# EAGLE board EEG_cap_final (EAGLE 9.6.2)
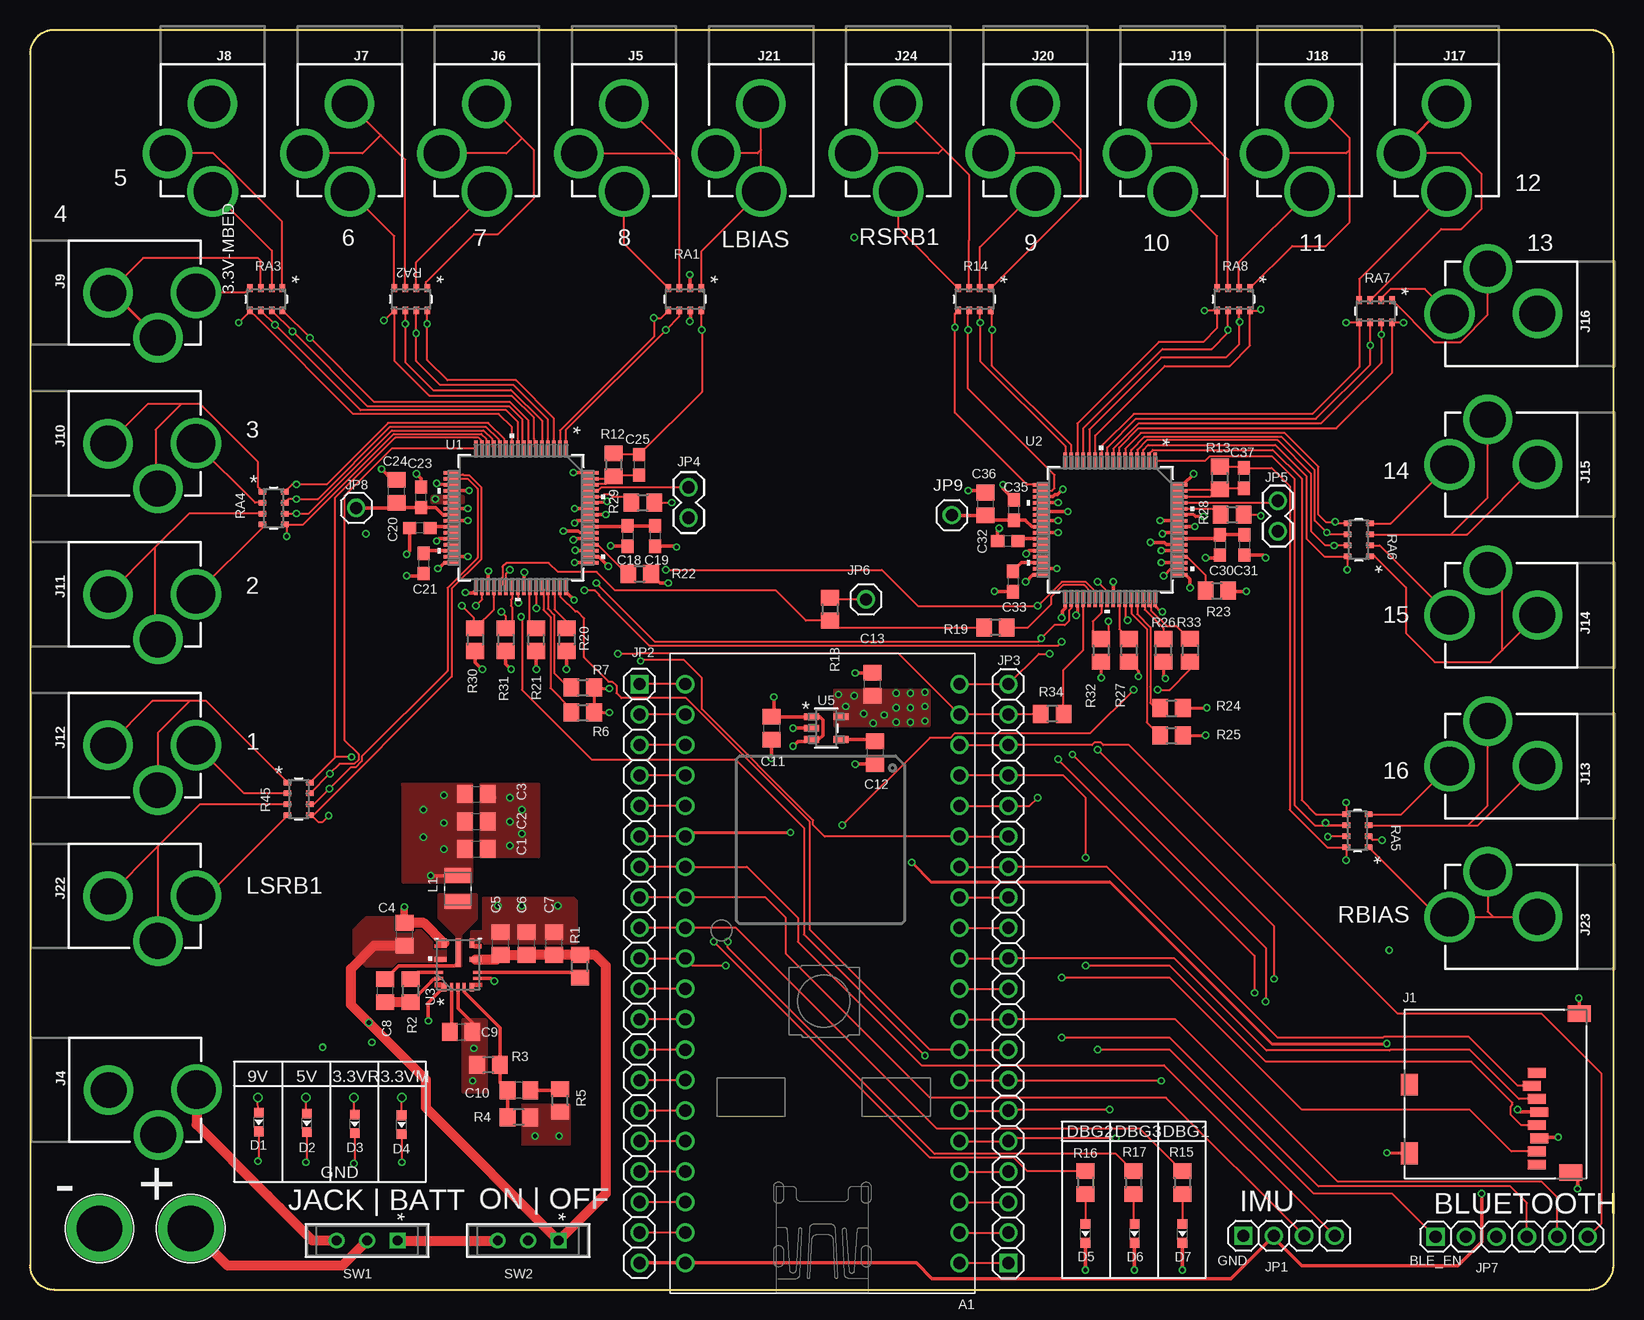
[diagram p4: board, top side]
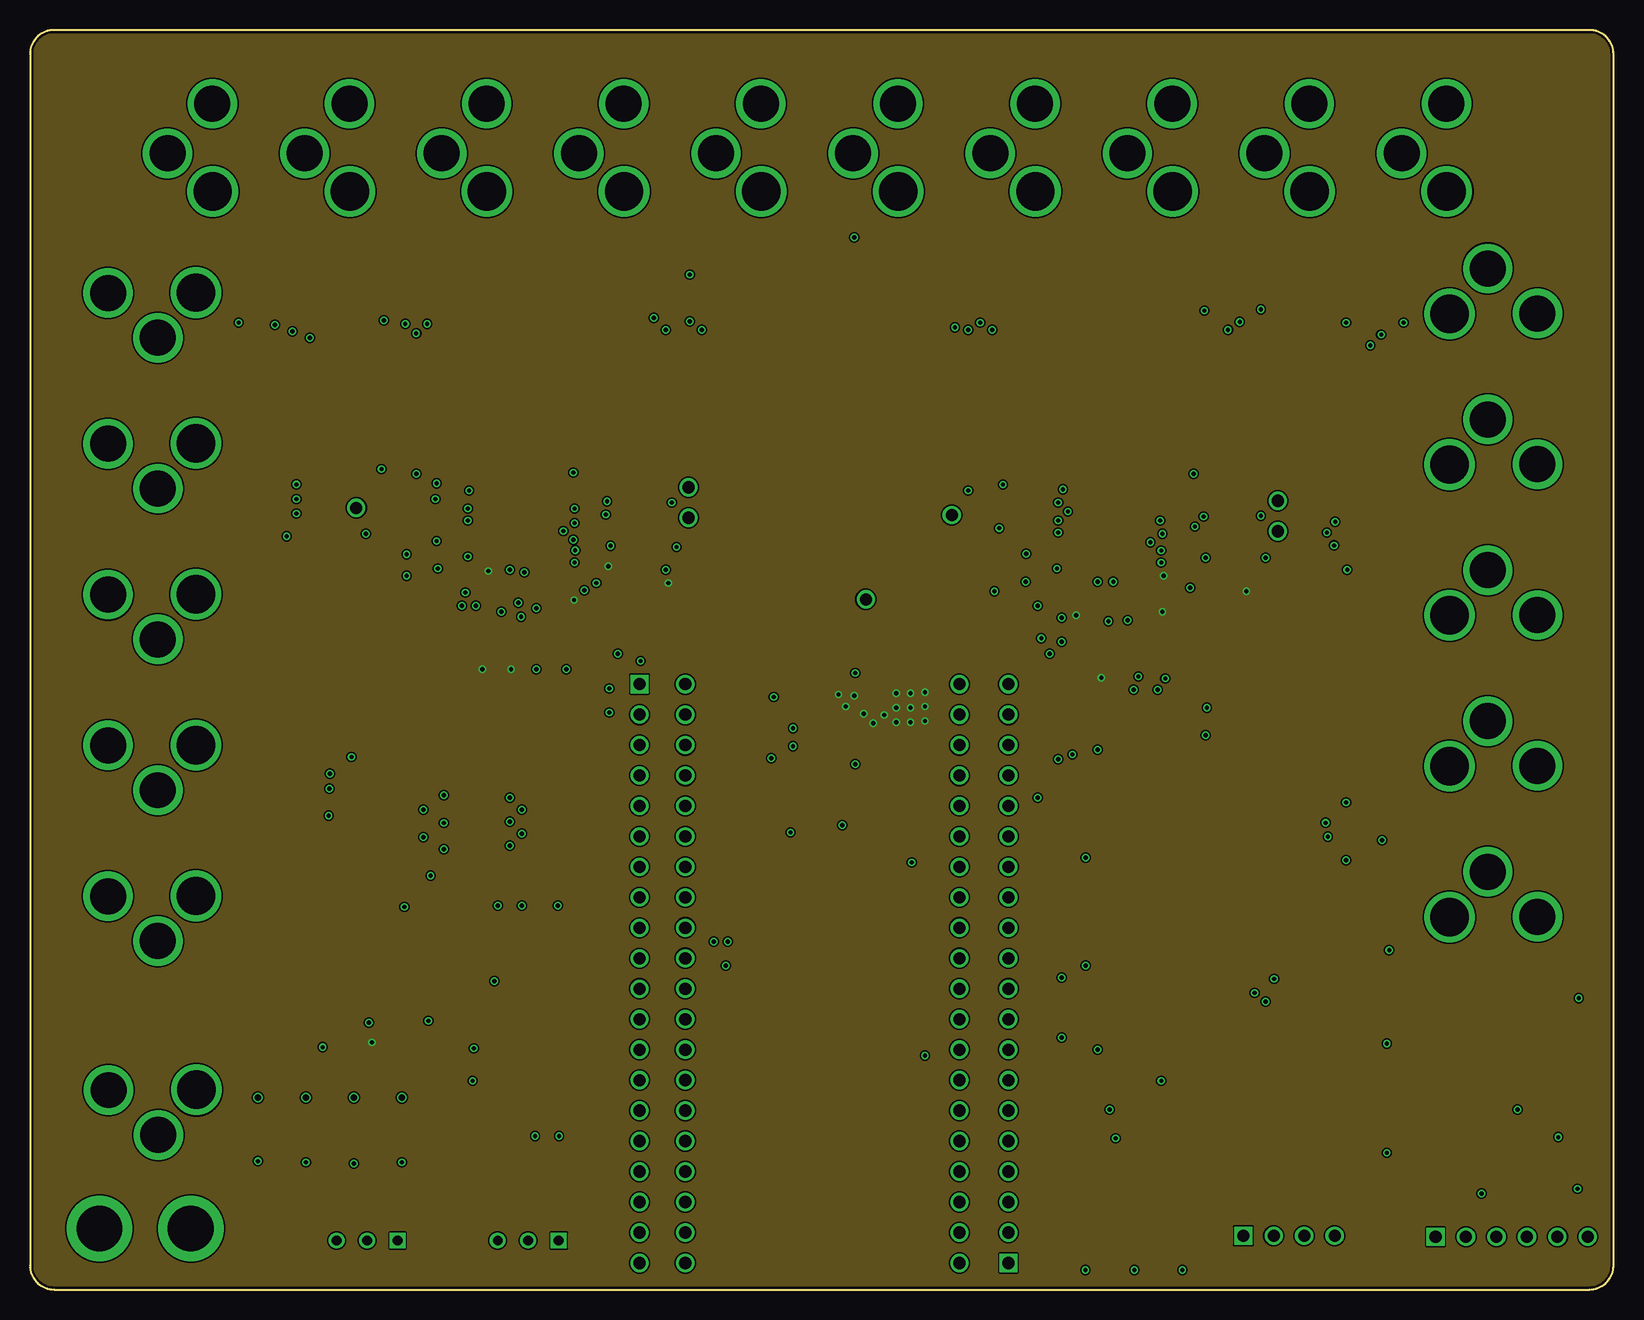
[diagram p5: board, inner layer Route2]
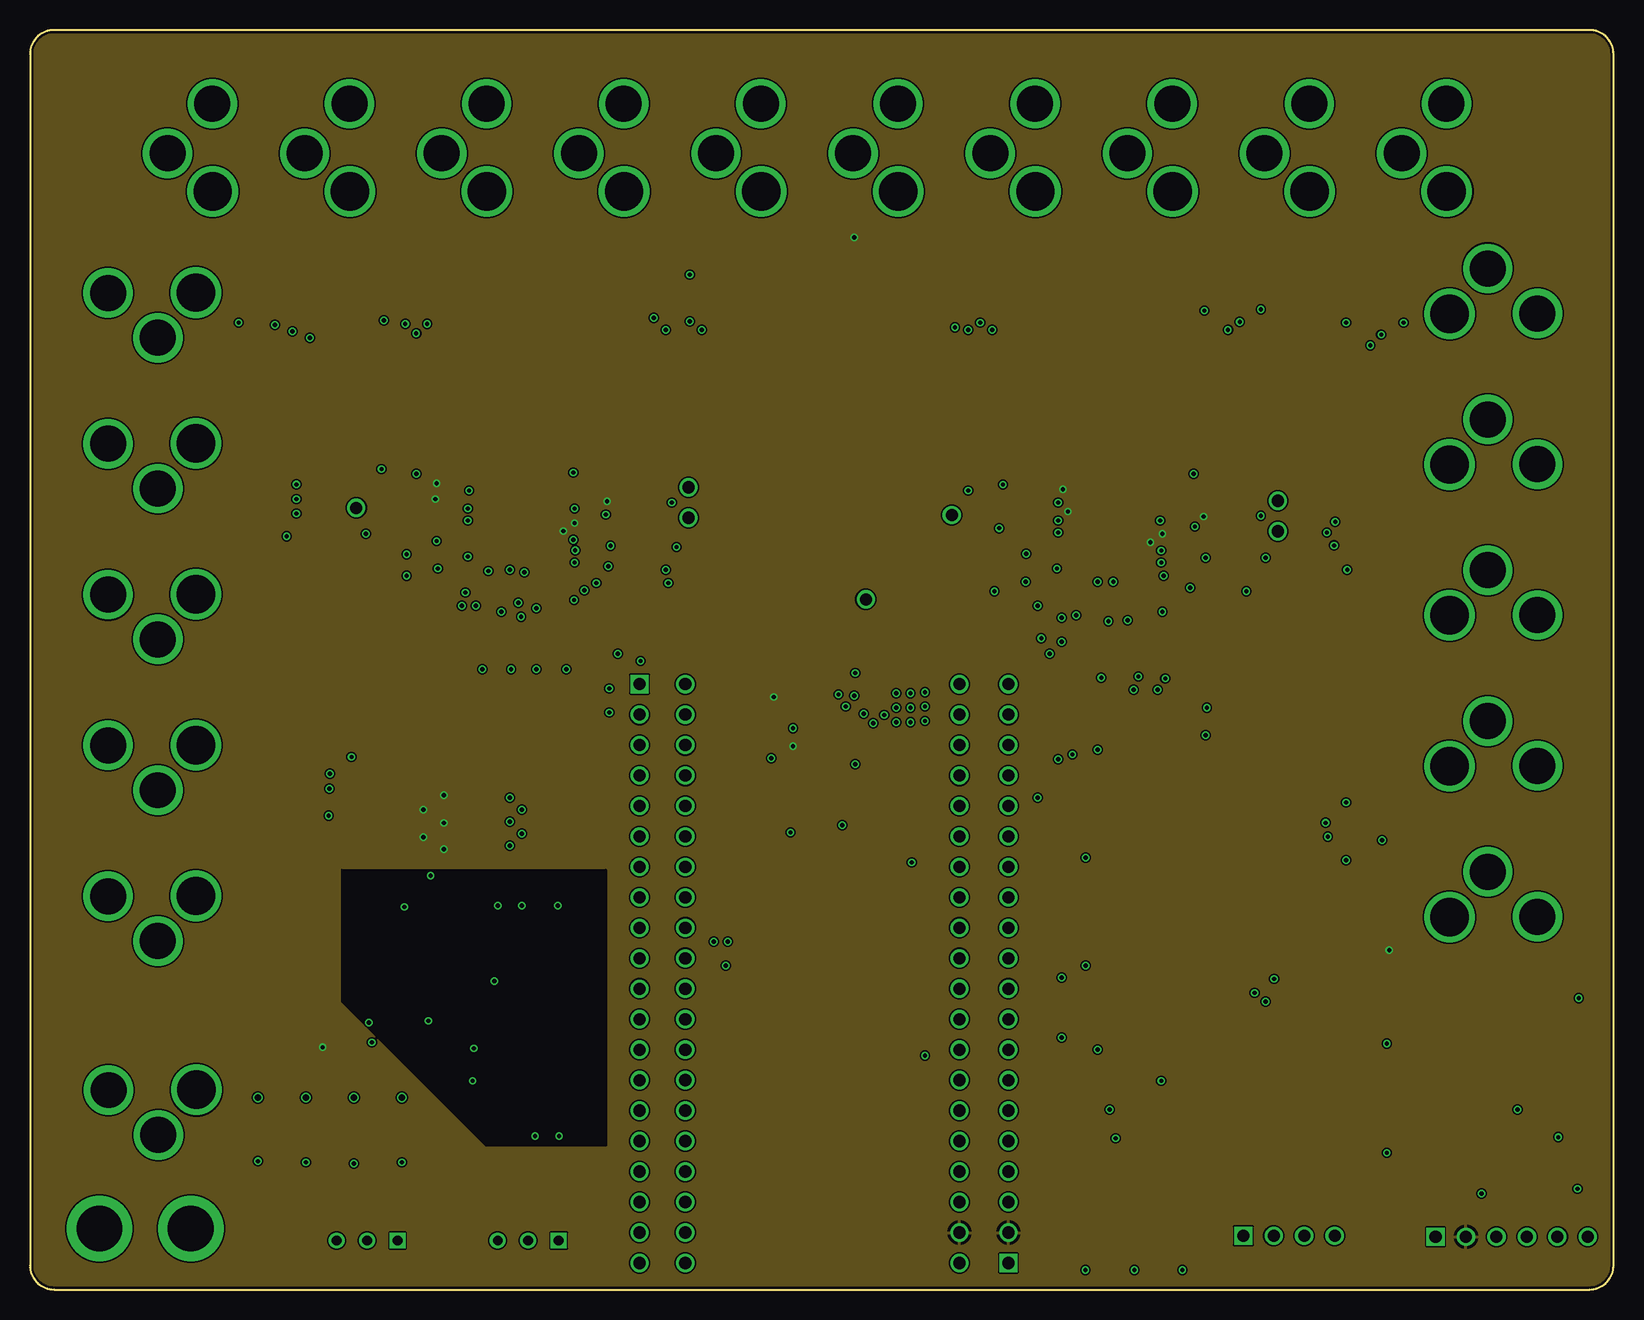
[diagram p6: board, inner layer Route15]
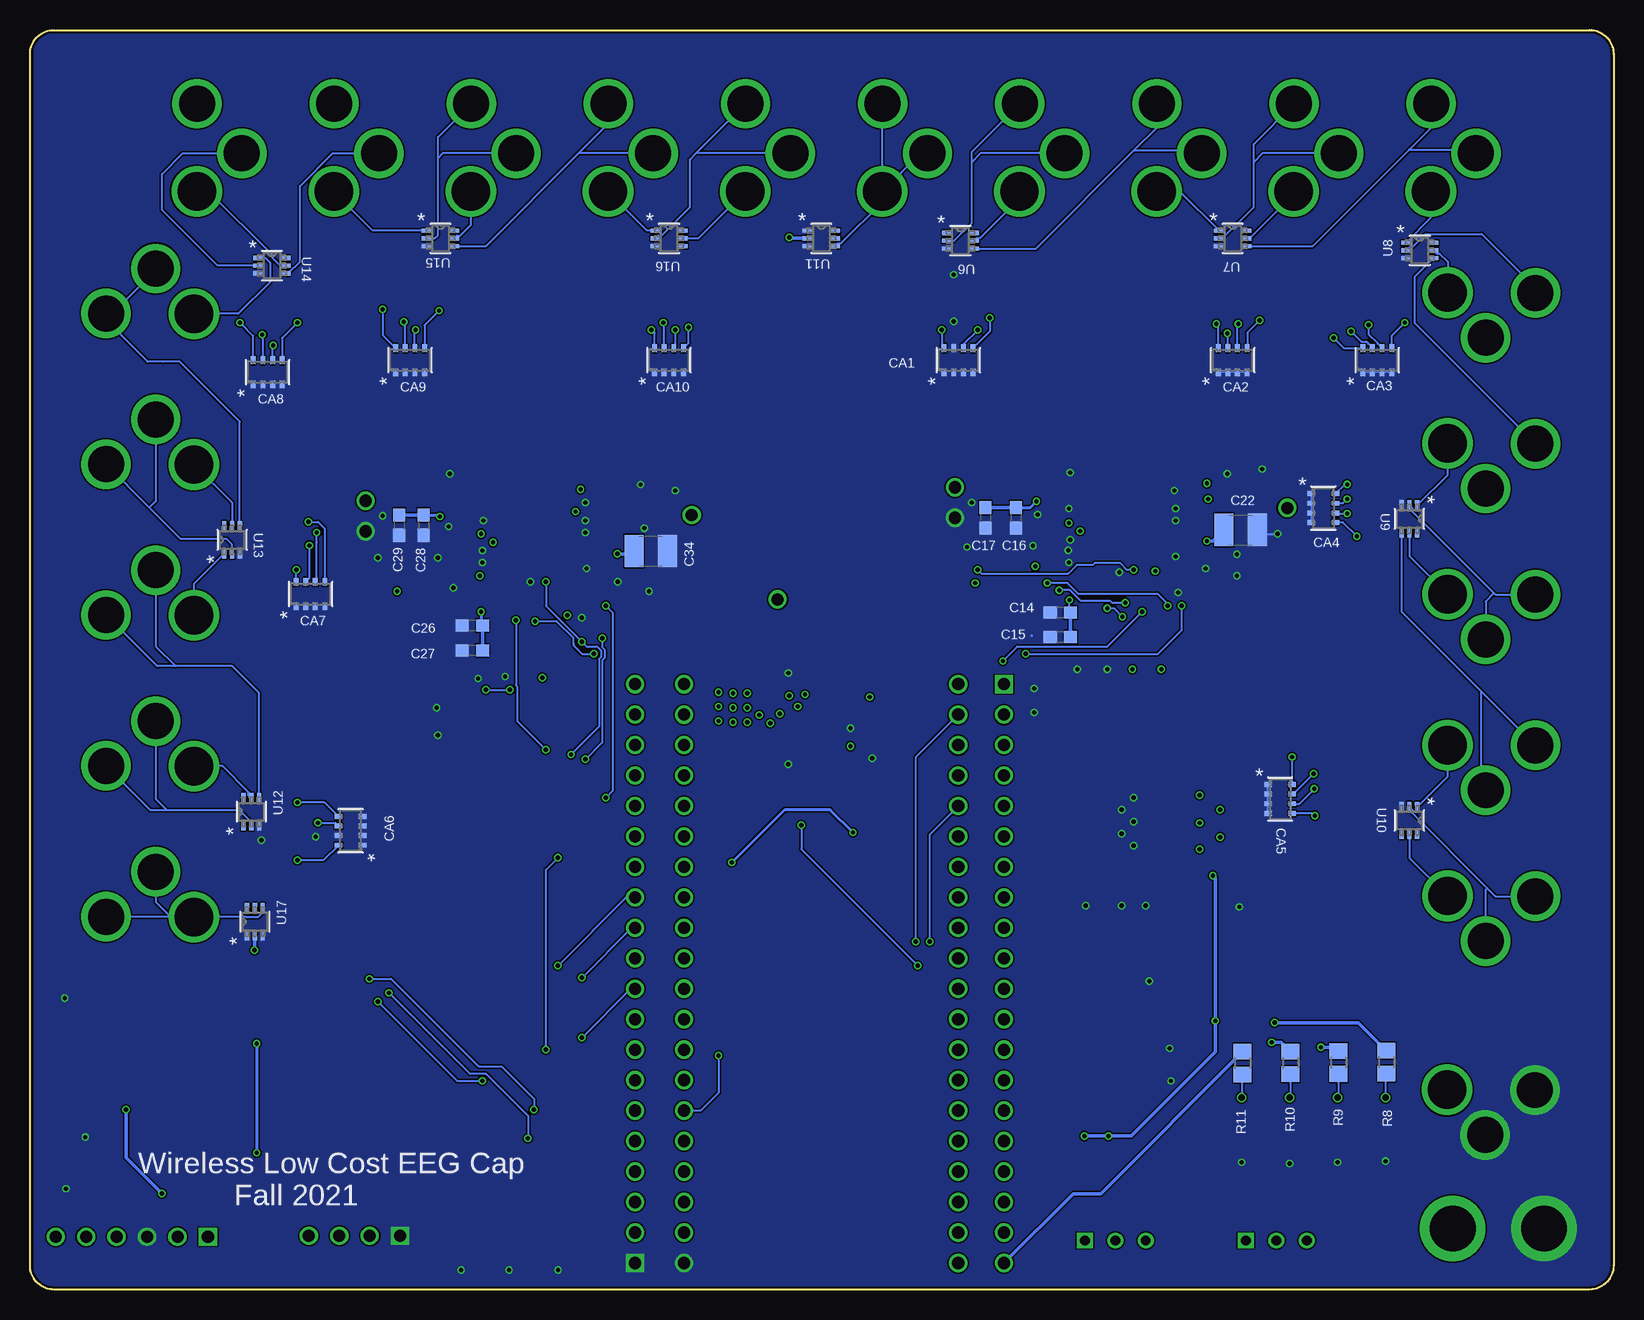
[diagram p7: board, bottom side, seen from below]

Size 132 x 105 mm. Coordinates in mm from the lower left corner, seen from the top.
Outline: 0,103 0,2 arc90 2,0 130,0 arc90 132,2 132,103 arc90 130,105 2,105 arc90 0,103
Copper layers (1+2*15+16): Top 0.035mm / dielectric 0.2mm / Route2 0.0175mm / dielectric 1.065mm / Route15 0.0175mm / dielectric 0.2mm / Bottom 0.035mm
Design rules "JLCPCB (4 Layer)": minimum track width 5mil, minimum drill 0.2mm, track to track 5mil, track to pad 5mil, pad to pad 5mil, via to via 20mil, smd to smd 5mil, copper to edge 0.2mm, drill to drill 21mil, minimum pad ring 6mil, minimum via ring 5mil, stop-mask expansion 2mil, vias tented up to drill 30mil, thermal gap 10mil

## Footprints (pad centres in the part's own frame; a part is rotated, then mirrored left to right if it is on the bottom)
MBED_LPC1768 = drill 1.02: D+ 11.43,1.27; D- 11.43,3.81; GND -11.43,24.13; IF+ 11.43,16.51; IF- 11.43,19.05; NR -11.43,16.51; P$5 -11.43,13.97; P$6 -11.43,11.43; P$7 -11.43,8.89; P$8 -11.43,6.35; P$9 -11.43,3.81; P$10 -11.43,1.27; P$11 -11.43,-1.27; P$12 -11.43,-3.81; P$13 -11.43,-6.35; P$14 -11.43,-8.89; P$15 -11.43,-11.43; P$16 -11.43,-13.97; P$17 -11.43,-16.51; P$18 -11.43,-19.05; P$19 -11.43,-21.59; P$20 -11.43,-24.13; P$21 11.43,-24.13; P$22 11.43,-21.59; P$23 11.43,-19.05; P$24 11.43,-16.51; P$25 11.43,-13.97; P$26 11.43,-11.43; P$27 11.43,-8.89; P$28 11.43,-6.35; P$29 11.43,-3.81; P$30 11.43,-1.27; RD+ 11.43,11.43; RD- 11.43,13.97; TD+ 11.43,6.35; TD- 11.43,8.89; VB -11.43,19.05; VIN -11.43,21.59; VOUT 11.43,24.13; VU 11.43,21.59
C0805 = smd 1.3 x 1.5: 1 -0.95,0; 2 0.95,0
C0603 = smd 1.1 x 1: 1 -0.85,0; 2 0.85,0
C1210 = smd 1.6 x 2.7: 1 -1.4,0; 2 1.4,0
CAP_CA0612_3P2X1P6_YAG = smd 0.634 x 0.408: 1 -1.009,1.2; 2 -1.009,0.4; 3 -1.009,-0.4; 4 -1.009,-1.2; 5 1.009,-1.2; 6 1.009,-0.4; 7 1.009,0.4; 8 1.009,1.2
LED0603 = smd 0.8 x 0.8: A -0.775,0; C 0.775,0
CONN_3M_2900 = smd 0.813 x 1.499: 1 -1.772,3.449; 2 -0.68,3.042; 3 0.412,3.449; 4 1.505,3.652; 5 2.597,3.449; 6 3.689,3.652; 7 4.781,3.449; 8 5.873,3.449 | smd 1.397 x 1.905: 9 -6.693,6.998; 10 6.551,6.276 | smd 1.803 x 1.397: 11 -0.775,-7.188; 12 4.94,-7.188
BANANA_CONN = drill 3.81 pad 5.461: P$1 0,0
POWER_JACK_PTH_LOCK = drill 2.997 pad 4.115: GND 0.025,6.557; GNDBREAK 3.762,10.7 | drill 3.2 pad 4.115: PWR 0,13.878
1X04 = drill 1.016 square: 1 -3.81,0 | drill 1.016: 2 -1.27,0; 3 1.27,0; 4 3.81,0
1X20 = drill 1.016 square: 1 -24.13,0 | drill 1.016: 2 -21.59,0; 3 -19.05,0; 4 -16.51,0; 5 -13.97,0; 6 -11.43,0; 7 -8.89,0; 8 -6.35,0; 9 -3.81,0; 10 -1.27,0; 11 1.27,0; 12 3.81,0; 13 6.35,0; 14 8.89,0; 15 11.43,0; 16 13.97,0; 17 16.51,0; 18 19.05,0; 19 21.59,0; 20 24.13,0
1X02 = drill 1.016: 1 -1.27,0; 2 1.27,0
1X01 = drill 1.016: 1 0,0
1X06 = drill 1.016 square: 1 -6.35,0 | drill 1.016: 2 -3.81,0; 3 -1.27,0; 4 1.27,0; 5 3.81,0; 6 6.35,0
INDC2520X100N = smd 1.24 x 2.22: 1 -1.09,0; 2 1.09,0
R0805 = smd 1.3 x 1.5: 1 -0.95,0; 2 0.95,0
BO_CAT16 = smd 0.634 x 0.459: 1 -0.933,1.372; 2 -0.933,0.457; 3 -0.933,-0.457; 4 -0.933,-1.372; 5 0.933,-1.372; 6 0.933,-0.457; 7 0.933,0.457; 8 0.933,1.372
SW_450301014042_WRE = drill 0.813 pad 1.321 square: 1 0,0 | drill 0.813 pad 1.321: 2 0,-2.54; 3 0,-5.08
PAG64_TEX = smd 1.341 x 0.279: 1 -5.776,3.75; 2 -5.776,3.25; 3 -5.776,2.75; 4 -5.776,2.25; 5 -5.776,1.75; 6 -5.776,1.25; 7 -5.776,0.75; 8 -5.776,0.25; 9 -5.776,-0.25; 10 -5.776,-0.75; 11 -5.776,-1.25; 12 -5.776,-1.75; 13 -5.776,-2.25; 14 -5.776,-2.75; 15 -5.776,-3.25; 16 -5.776,-3.75; 33 5.776,-3.75; 34 5.776,-3.25; 35 5.776,-2.75; 36 5.776,-2.25; 37 5.776,-1.75; 38 5.776,-1.25; 39 5.776,-0.75; 40 5.776,-0.25; 41 5.776,0.25; 42 5.776,0.75; 43 5.776,1.25; 44 5.776,1.75; 45 5.776,2.25; 46 5.776,2.75; 47 5.776,3.25; 48 5.776,3.75 | smd 0.279 x 1.341: 17 -3.75,-5.776; 18 -3.25,-5.776; 19 -2.75,-5.776; 20 -2.25,-5.776; 21 -1.75,-5.776; 22 -1.25,-5.776; 23 -0.75,-5.776; 24 -0.25,-5.776; 25 0.25,-5.776; 26 0.75,-5.776; 27 1.25,-5.776; 28 1.75,-5.776; 29 2.25,-5.776; 30 2.75,-5.776; 31 3.25,-5.776; 32 3.75,-5.776; 49 3.75,5.776; 50 3.25,5.776; 51 2.75,5.776; 52 2.25,5.776; 53 1.75,5.776; 54 1.25,5.776; 55 0.75,5.776; 56 0.25,5.776; 57 -0.25,5.776; 58 -0.75,5.776; 59 -1.25,5.776; 60 -1.75,5.776; 61 -2.25,5.776; 62 -2.75,5.776; 63 -3.25,5.776; 64 -3.75,5.776
VQFN-HR14_RJR_TEX = smd 0.711 x 0.406: 1 -1.85,1.15; 5 -1.85,-1.15 | smd 0.711 x 0.254: 2 -1.85,0.525; 4 -1.85,-0.525 | smd 0.711 x 0.305: 3 -1.85,0 | smd 0.254 x 0.711: 6 -1.125,-1.6; 7 -0.625,-1.6; 13 -0.625,1.6; 14 -1.125,1.6 | smd 0.406 x 0.991: 8 0.45,-1.45; 12 0.45,1.45 | smd 0.813 x 0.406: 9 1.8,-1.15; 11 1.8,1.15 | smd 2.388 x 0.406: 10 1,0
MF05A = smd 1.259 x 0.568: 1 -1.219,0.953; 2 -1.219,0; 3 -1.219,-0.953; 4 1.219,-0.953; 5 1.219,0.953
DCK6_TEX = smd 0.845 x 0.355: 1 -1.134,0.65; 2 -1.134,0; 3 -1.134,-0.65; 4 1.134,-0.65; 5 1.134,0; 6 1.134,0.65

## Placement (x,y rotation side)
A1  MBED_NXP_LPC1768  [MBED_LPC1768]  66.05,26.34 180 top
C1  22uF  [C0805]  37.2,36.72 0 top
C2  22uF  [C0805]  37.2,39.01 0 top
C3  22uF  [C0805]  37.2,41.29 0 top
C4  0.1uF  [C0805]  31.23,29.61 90 top
C5  0.1uF  [C0805]  39.24,28.85 90 top
C6  4.7uF  [C0805]  41.4,28.85 90 top
C7  4.7uF  [C0805]  43.68,28.85 90 top
C8  0.1uF  [C0805]  29.58,24.91 270 top
C9  1uF  [C0805]  35.93,21.48 0 top
C10  33pF  [C0805]  40.76,16.61 180 top
C11  1uF  [C0805]  61.8,46.8 270 top
C12  0.01uF  [C0805]  70.44,44.76 270 top
C13  4.7uF  [C0805]  70.24,50.45 90 top
C14  0.1uF  [C0603]  46.11,56.42 180 bottom
C15  1uF  [C0603]  46.11,54.38 180 bottom
C16  0.1uF  [C0603]  49.82,64.34 270 bottom
C17  1uF  [C0603]  52.36,64.34 270 bottom
C18  0.1uF  [C0603]  49.82,62.82 270 top
C19  1uF  [C0603]  52.11,62.82 270 top
C20  1uF  [C0603]  32.49,63.5 180 top
C21  1uF  [C0603]  32.8,60.53 270 top
C22  100uF  [C1210]  31.09,63.32 0 bottom
C23  0.1uF  [C0603]  32.6,66.04 90 top
C24  10uF  [C0805]  30.57,66.55 90 top
C25  1nF  [C0603]  50.78,68.75 270 top
C26  0.1uF  [C0603]  95.13,55.34 180 bottom
C27  1uF  [C0603]  95.13,53.28 180 bottom
C28  0.1uF  [C0603]  99.19,63.72 270 bottom
C29  1uF  [C0603]  101.23,63.72 270 bottom
C30  0.1uF  [C0603]  99.19,62.07 270 top
C31  1uF  [C0603]  101.23,62.07 270 top
C32  1uF  [C0603]  81.51,62.39 180 top
C33  1uF  [C0603]  81.92,59.02 270 top
C34  100uF  [C1210]  80.25,61.56 0 bottom
C35  0.1uF  [C0603]  82.02,64.98 90 top
C36  10uF  [C0805]  79.66,65.49 90 top
C37  1nF  [C0603]  101.21,67.65 270 top
CA1  4.7nF  [CAP_CA0612_3P2X1P6_YAG]  54.6,77.47 90 bottom
CA2  4.7nF  [CAP_CA0612_3P2X1P6_YAG]  31.74,77.47 90 bottom
CA3  4.7nF  [CAP_CA0612_3P2X1P6_YAG]  19.69,77.47 90 bottom
CA4  4.7nF  [CAP_CA0612_3P2X1P6_YAG]  24.19,65.14 0 bottom
CA5  4.7nF  [CAP_CA0612_3P2X1P6_YAG]  27.79,40.9 0 bottom
CA6  4.7nF  [CAP_CA0612_3P2X1P6_YAG]  105.28,38.24 180 bottom
CA7  4.7nF  [CAP_CA0612_3P2X1P6_YAG]  108.61,57.98 90 bottom
CA8  4.7nF  [CAP_CA0612_3P2X1P6_YAG]  112.18,76.47 90 bottom
CA9  4.7nF  [CAP_CA0612_3P2X1P6_YAG]  100.32,77.47 90 bottom
CA10  4.7nF  [CAP_CA0612_3P2X1P6_YAG]  78.73,77.47 90 bottom
D1  LED-SMD  [LED0603]  19.08,13.96 270 top
D2  LED-SMD  [LED0603]  23.08,13.89 270 top
D3  LED-SMD  [LED0603]  27.08,13.82 270 top
D4  LED-SMD  [LED0603]  30.98,13.75 270 top
D5  BLUE  [LED0603]  87.98,4.67 270 top
D6  BLUE  [LED0603]  92.07,4.67 270 top
D7  LED-SMD  [LED0603]  96.06,4.67 270 top
J1  2908-05WB-MG  [CONN_3M_2900]  122.16,16.3 270 top
J2  +9V  [BANANA_CONN]  13.4,5.08 0 top
J3  GND  [BANANA_CONN]  5.78,5.08 0 top
J4  POWER_JACKPTH_LOCK  [POWER_JACK_PTH_LOCK]  0,16.65 270 top
J5  POWER_JACKPTH_LOCK  [POWER_JACK_PTH_LOCK]  49.52,105.41 180 top
J6  POWER_JACKPTH_LOCK  [POWER_JACK_PTH_LOCK]  38.09,105.41 180 top
J7  POWER_JACKPTH_LOCK  [POWER_JACK_PTH_LOCK]  26.66,105.41 180 top
J8  POWER_JACKPTH_LOCK  [POWER_JACK_PTH_LOCK]  15.23,105.41 180 top
J9  POWER_JACKPTH_LOCK  [POWER_JACK_PTH_LOCK]  -0.05,83.1 270 top
J10  POWER_JACKPTH_LOCK  [POWER_JACK_PTH_LOCK]  -0.05,70.53 270 top
J11  POWER_JACKPTH_LOCK  [POWER_JACK_PTH_LOCK]  -0.05,57.96 270 top
J12  POWER_JACKPTH_LOCK  [POWER_JACK_PTH_LOCK]  -0.05,45.39 270 top
J13  POWER_JACKPTH_LOCK  [POWER_JACK_PTH_LOCK]  132.22,43.63 90 top
J14  POWER_JACKPTH_LOCK  [POWER_JACK_PTH_LOCK]  132.22,56.2 90 top
J15  POWER_JACKPTH_LOCK  [POWER_JACK_PTH_LOCK]  132.22,68.77 90 top
J16  POWER_JACKPTH_LOCK  [POWER_JACK_PTH_LOCK]  132.22,81.35 90 top
J17  POWER_JACKPTH_LOCK  [POWER_JACK_PTH_LOCK]  118.1,105.41 180 top
J18  POWER_JACKPTH_LOCK  [POWER_JACK_PTH_LOCK]  106.67,105.41 180 top
J19  POWER_JACKPTH_LOCK  [POWER_JACK_PTH_LOCK]  95.24,105.41 180 top
J20  POWER_JACKPTH_LOCK  [POWER_JACK_PTH_LOCK]  83.81,105.41 180 top
J21  POWER_JACKPTH_LOCK  [POWER_JACK_PTH_LOCK]  60.95,105.41 180 top
J22  POWER_JACKPTH_LOCK  [POWER_JACK_PTH_LOCK]  -0.05,32.82 270 top
J23  POWER_JACKPTH_LOCK  [POWER_JACK_PTH_LOCK]  132.22,31.06 90 top
J24  POWER_JACKPTH_LOCK  [POWER_JACK_PTH_LOCK]  72.38,105.41 180 top
JP1  [1X04]  104.95,4.48 0 top
JP2  [1X20]  50.81,26.34 270 top
JP3  [1X20]  81.56,26.34 90 top
JP4  [1X02]  54.9,65.61 90 top
JP5  [1X02]  104.02,64.48 90 top
JP6  [1X01]  69.68,57.53 0 top
JP7  [1X06]  123.51,4.4 0 top
JP8  [1X01]  27.2,65.16 0 top
JP9  [1X01]  76.84,64.56 0 top
L1  DFE252010P-1R5M=P2  [INDC2520X100N]  35.68,33.42 90 top
R1  10k  [R0805]  45.84,26.94 90 top
R2  100  [R0805]  31.74,24.91 90 top
R3  24.9k  [R0805]  38.22,18.72 180 top
R4  100k  [R0805]  40.76,14.37 180 top
R5  1k  [R0805]  44.19,15.77 90 top
R6  10k  [R0805]  46.07,48.1 0 top
R7  10k  [R0805]  46.07,50.19 0 top
R8  300  [R0805]  18.92,18.96 270 bottom
R9  91  [R0805]  22.92,18.93 270 bottom
R10  5  [R0805]  26.92,18.9 270 bottom
R11  5  [R0805]  30.92,18.87 270 bottom
R12  10k  [R0805]  48.64,68.75 270 top
R13  10k  [R0805]  99.17,67.66 270 top
R14  4.99k  [BO_CAT16]  78.73,82.55 270 top
R15  1k  [R0805]  96.06,8.92 270 top
R16  1k  [R0805]  87.98,8.92 270 top
R17  1k  [R0805]  91.97,8.92 270 top
R18  0  [R0805]  66.68,56.72 270 top
R19  0  [R0805]  80.48,55.2 180 top
R20  10k  [R0805]  44.74,54.18 270 top
R21  10k  [R0805]  42.2,54.18 90 top
R22  0  [R0805]  50.82,59.66 0 top
R23  0  [R0805]  98.94,58.26 0 top
R24  10k  [R0805]  95.15,48.47 0 top
R25  10k  [R0805]  95.15,46.18 0 top
R26  10k  [R0805]  94.46,53.28 270 top
R27  10k  [R0805]  91.62,53.28 90 top
R28  0  [R0805]  100.21,64.61 0 top
R29  0  [R0805]  51.09,65.61 0 top
R30  10k  [R0805]  37.12,54.18 270 top
R31  1k  [R0805]  39.66,54.18 270 top
R32  1k  [R0805]  89.28,53.28 270 top
R33  0  [R0805]  96.7,53.3 270 top
R34  0  [R0805]  85.2,48 180 top
R45  4.99k  [BO_CAT16]  22.41,40.9 0 top
RA1  4.99k  [BO_CAT16]  54.6,82.55 270 top
RA2  4.99k  [BO_CAT16]  31.74,82.55 270 top
RA3  4.99k  [BO_CAT16]  19.69,82.55 270 top
RA4  4.99k  [BO_CAT16]  20.3,65.14 0 top
RA5  4.99k  [BO_CAT16]  110.67,38.24 180 top
RA6  4.99k  [BO_CAT16]  110.77,62.49 180 top
RA7  4.99k  [BO_CAT16]  112.18,81.55 270 top
RA8  4.99k  [BO_CAT16]  100.32,82.55 270 top
SW1  450301014042  [SW_450301014042_WRE]  30.64,4.08 270 top
SW2  450301014042  [SW_450301014042_WRE]  44.07,4.08 270 top
U1  ADS1299IPAG  [PAG64_TEX]  40.93,64.34 270 top
U2  ADS1299IPAG  [PAG64_TEX]  90.05,63.34 270 top
U3  LM62435BPPQRJRRQ1  [VQFN-HR14_RJR_TEX]  35.68,27.07 90 top
U5  LP2982IM5-3.3/NOPB  [MF05A]  66.38,46.8 0 top
U6  TPD4E1B06DCKR  [DCK6_TEX]  54.44,87.43 0 bottom
U7  TPD4E1B06DCKR  [DCK6_TEX]  31.74,87.63 0 bottom
U8  TPD4E1B06DCKR  [DCK6_TEX]  16.15,86.63 0 bottom
U9  TPD4E1B06DCKR  [DCK6_TEX]  17.02,64.25 270 bottom
U10  TPD4E1B06DCKR  [DCK6_TEX]  17.02,39.1 270 bottom
U11  TPD4E1B06DCKR  [DCK6_TEX]  66.03,87.63 0 bottom
U12  TPD4E1B06DCKR  [DCK6_TEX]  113.55,39.82 90 bottom
U13  TPD4E1B06DCKR  [DCK6_TEX]  115.16,62.49 90 bottom
U14  TPD4E1B06DCKR  [DCK6_TEX]  111.83,85.36 0 bottom
U15  TPD4E1B06DCKR  [DCK6_TEX]  97.78,87.63 0 bottom
U16  TPD4E1B06DCKR  [DCK6_TEX]  78.73,87.63 0 bottom
U17  TPD4E1B06DCKR  [DCK6_TEX]  113.26,30.67 90 bottom

## Tracks (layer width: path | path; a pad name or v marks a point on that pad's centre or on a via)
1N
  Top 0.152: R45.1 14.69,49.05 13.3,49.05 | J12.GND 10.2,49.05 13.3,49.05 | 13.3,49.05 10.65,46.4 J12.GNDBREAK
  Bottom 0.152: U9.4 17.67,56.52 11.05,49.9 | 11.05,49.9 J12.GND | 11.05,49.9 11.05,42.02 J12.GNDBREAK
1P
  Top 0.152: R45.2 17.87,41.35 J12.PWR
  Bottom 0.152: U10.1 13.83,42.77 J12.PWR
2N
  Top 0.152: RA4.3 13.26,64.69 10.42,61.84 | 10.42,61.84 J11.GND | 10.42,61.84 10.42,54.44 J11.GNDBREAK
  Bottom 0.152: U9.2 16.77,65.14 16.77,64.86 9.96,58.05 | 9.96,58.05 9.85,57.93 J11.GND | 9.96,58.05 10.65,57.36 J11.GNDBREAK
2P
  Top 0.152: RA4.4 19.37,63.5 J11.PWR
  Bottom 0.152: U9.5 17.02,61.14 J11.PWR
3.3_ANA_LED  (via drill 0.55)
  Top 0.152: D3.A 27,14.68 v27,16
  Bottom 0.152: v27,16 26.92,16.08 R10.2
3.3V_DIG_LED  (via drill 0.55)
  Top 0.152: D4.A 30.98,15.98 v31,16
  Bottom 0.152: R11.2 31,17.84 v31,16
3N
  Top 0.152: J10.GND 9.8,73.8 12.6,73.8 | 12.6,73.8 12.34,73.54 10.48,71.68 10.48,66.95 J10.GNDBREAK | RA4.1 19,66.89 19,69 14.2,73.8 12.6,73.8
  Bottom 0.152: U8.4 16.6,84.4 16.6,80.59 J10.GND
3P
  Top 0.152: RA4.2 18.76,65.6 J10.PWR
  Bottom 0.152: U9.1 13.83,67.92 J10.PWR
4N
  Top 0.152: RA3.3 19.23,85.77 19,86 9.43,86 J9.GND
  Top 0.254: J9.GNDBREAK 6.92,83.08 J9.GND
  Bottom 0.152: U8.2 17.01,86.9 16.78,86.9 15.68,88 11,88 6.51,83.51 J9.GND
4P
  Top 0.152: RA3.4 17.94,83.11 J9.PWR
  Bottom 0.152: U8.5 14.75,86.36 14.51,86.36 13.83,85.68 J9.PWR
5N
  Top 0.152: RA3.1 21,83.55 21,89.03 16.19,93.84 16.16,93.84 15.29,94.71 J8.GNDBREAK
  Bottom 0.152: U7.4 25.08,86.98 17.03,95.03 | 17.03,95.03 15.21,96.85 J8.GND | 17.03,95.03 11.79,95.03 J8.GNDBREAK
5P
  Top 0.152: J8.PWR 20.15,86.61 RA3.2
  Bottom 0.152: U8.1 15.23,89.33 J8.PWR
5V_LED  (via drill 0.55)
  Top 0.152: D2.A 23,14.74 v23,16
  Bottom 0.152: R9.2 22.92,16.08 v23,16
6N
  Top 0.152: RA2.3 31.28,94.2 29.24,96.24 | 29.24,96.24 J7.GND | 29.24,96.24 27.71,94.71 J7.GNDBREAK
  Bottom 0.152: U7.2 32.83,87.67 32.56,87.67 30,90.23 30,94 | J7.GND 30,95.49 30,94 | J7.GNDBREAK 29.29,94.71 30,94
6P
  Top 0.152: RA2.4 30.37,87.82 J7.PWR
  Bottom 0.152: J7.PWR 26.66,91.3 30.33,87.63 U7.5
7N
  Top 0.152: RA2.1 33,83.59 33,84 37,88 39,88 42,91 42,95 41,96 | 41,96 38.15,98.85 J6.GND | 41,96 39.71,94.71 J6.GNDBREAK
  Bottom 0.152: U6.4 48.14,86.78 39.96,94.96 | 39.96,94.96 38.06,96.85 J6.GND | 39.96,94.96 34.58,94.96 J6.GNDBREAK
7P
  Top 0.152: RA2.2 32.2,85.64 J6.PWR
  Bottom 0.152: U7.1 36.13,91.53 J6.PWR
8N
  Top 0.152: RA1.3 54.14,94.2 53.67,94.67 | 53.67,94.67 J5.GND | 53.67,94.67 45.8,94.67 J5.GNDBREAK
  Bottom 0.152: U6.2 54.97,87.43 53.5,88.9 53.5,94 | J5.GND 53.5,94.85 53.5,94 | J5.GNDBREAK 52.79,94.71 53.5,94
8P
  Top 0.152: RA1.4 49.52,87.19 J5.PWR
  Bottom 0.152: U6.5 53.06,87.67 52.79,87.67 49.52,90.94 J5.PWR
9N
  Top 0.152: R14.1 87.6,90.98 87.6,94 | J20.GND 87.6,95.04 87.6,94 | 87.6,94 86.89,94.71 J20.GNDBREAK
  Bottom 0.152: U15.4 96.63,87 94,87 86.29,94.71 | 86.29,94.71 83.78,97.22 J20.GND | J20.GNDBREAK 86.29,94.71
9P
  Top 0.152: R14.2 79.19,86.91 J20.PWR
  Bottom 0.152: U16.1 80.56,88.28 J20.PWR
9V_LED  (via drill 0.55)
  Top 0.152: D1.A 18.92,15.92 v19,16
  Bottom 0.152: v19,16 19,17.93 R8.2
10N
  Top 0.152: RA8.3 99.86,94.2 98.53,95.53 | 98.53,95.53 J19.GND | 98.53,95.53 92.3,95.53 J19.GNDBREAK
  Bottom 0.152: U15.2 98.27,87.63 98,87.9 98,94.3 | J19.GND 98,96.07 98,94.3 | J19.GNDBREAK 97.59,94.71 98,94.3
10P
  Top 0.152: RA8.4 98.95,87.82 J19.PWR
  Bottom 0.152: U15.5 96.4,87.87 96.13,87.87 95.24,88.76 J19.PWR
11N
  Top 0.152: RA8.1 105.21,87 108,87 110,89 110,95 | 110,95 110,96 107.15,98.85 J18.GND | 110,95 109.71,94.71 J18.GNDBREAK
  Bottom 0.152: J18.GNDBREAK 106.79,94.71 109.5,92 109.5,85.67 110.46,84.71 U14.4
11P
  Top 0.152: RA8.2 100.78,85.64 J18.PWR
  Bottom 0.152: U15.1 103.42,88.28 J18.PWR
12N
  Top 0.152: RA7.3 117.64,88.4 119.3,88.4 121,90.1 121,93 119.29,94.71 J17.GNDBREAK
  Top 0.254: J17.GND 114.34,95.12 J17.GNDBREAK
  Bottom 0.152: U14.2 116.36,85.36 121,90 121,93 119.29,94.71 J17.GNDBREAK
12P
  Top 0.152: J17.PWR 110.81,84.24 RA7.4
  Bottom 0.152: J17.PWR 117.11,91.53 111.79,86.21 111.79,86 111.15,85.36 U14.5
13N
  Top 0.152: RA7.1 117.03,79 119.26,79 121.52,81.25 J16.GNDBREAK
  Bottom 0.152: U13.4 114.51,72.34 119.5,77.34 120.92,77.34 122.19,77.34 125.66,80.81 J16.GND 125.15,81.37 121.52,85 J16.GNDBREAK
13P
  Top 0.152: J16.PWR 116.29,83.4 113.4,83.4 112.64,82.64 RA7.2
  Bottom 0.152: U14.1 112.41,86.01 112,85.6 112,84 114.65,81.35 J16.PWR
14N
  Top 0.152: RA6.3 118.44,62.94 | 118.44,62.94 119.81,62.94 J15.GND | 118.44,62.94 121.52,66.02 J15.GNDBREAK
  Bottom 0.152: U13.2 115.16,62.1 115.61,62.56 119.43,62.56 122.05,65.18 | 122.05,65.18 J15.GND | J15.GNDBREAK 121.52,65.71 122.05,65.18
14P
  Top 0.152: RA6.4 113.43,63.86 J15.PWR
  Bottom 0.152: J15.PWR 115.16,65.59 U13.5
15N
  Top 0.152: RA6.1 112.05,61.12 112.08,61.15 114.7,58.53 114.7,54.72 117.1,52.31 121.75,52.31 122.75,53.31 | 122.75,53.31 J14.GND | 122.75,53.31 122.75,58.73 J14.GNDBREAK
  Bottom 0.152: U12.4 112.9,49.72 115.14,51.96 119.86,51.96 | J14.GND 121.39,51.96 119.86,51.96 | J14.GNDBREAK 121.52,53.62 119.86,51.96
15P
  Top 0.152: RA6.2 112.51,62.03 J14.PWR
  Bottom 0.152: U13.1 118.34,58.82 J14.PWR
16N
  Top 0.152: RA5.3 119.86,38.7 | 119.86,38.7 120.7,38.7 J13.GND | 119.86,38.7 121.52,40.36 J13.GNDBREAK
  Bottom 0.152: U12.2 113.51,38.73 113.51,38.92 114.52,39.94 120.56,39.94 | J13.GND 121.94,39.94 120.56,39.94 | J13.GNDBREAK 121.52,40.89 120.56,39.94
16P
  Top 0.152: RA5.4 114.32,39.61 J13.PWR
  Bottom 0.152: U12.5 113.79,41.2 113.79,41.48 115.95,43.63 J13.PWR
!CS!_ADS_0  (via drill 0.35)
  Top 0.152: JP3.15 A1.P$15 66.23,37.77 65.28,38.72 65.28,39.12 56,48.4 56,51 54.5,52.5 51,52.5 v50.9,52.4 | v39.3,56.5 39.66,56.14 R31.1 40.18,55.65 40.18,56.91 40.09,56.99 40.09,57.5 40.18,57.58 U1.39
  Bottom 0.152: v50.9,52.4 49.69,53.61 42.19,53.61 v39.3,56.5
!CS!_ADS_1  (via drill 0.35)
  Top 0.152: A1.P$20 JP3.20 84.09,53 v85,53 | U2.39 89.3,56.4 88.6,55.7 88.6,54.91 89.25,54.26 | 89.25,54.26 R32.1 | v89.9,55.7 89.9,54.9 89.25,54.26
  Bottom 0.152: v89.9,55.7 88.09,55.7 86.7,54.3 86.7,53.84 86.7,53.7 86,53 v85,53
!CS!_SD
  Top 0.152: A1.P$14 81,35.23 JP3.14 89.77,35.23 104,21 112.78,21 112.86,21.08 119.92,21.08 124.02,16.98 J1.2
!DRDY!_1
  Top 0.152: R33.1 96.61,54.25 95.55,55.32 94.76,55.32 93.46,56.62 93.46,57.41 U2.47
!DRDY!_ADS_0
  Top 0.152: JP3.8 A1.P$8 75.01,19.99 65,30 65,39 54.7,49.3 49.3,49.3 48.88,49.72 48.88,50.34 48.54,50.68 48.21,50.68 46.2,52.69 46.2,55.95 45.64,56.51 45.46,56.51 44.24,57.73 44.24,58.51 U1.47
!DRDY!_ADS_1  (via drill 0.35, 0.35 pad 0.55)
  Top 0.152: JP2.10 A1.P$30 55.23,27 v58,27 | v94,50 95,50 96.7,51.7 R33.2 | v92,50 88.36,46.36 77.08,46.36 76.72,46 75,46 v67.7,38.7
  Bottom 0.152: v94,50 v92,50 | v67.7,38.7 67.7,36.7 v58,27
!RESET!_ADS  (via drill 0.35)
  Top 0.152: v36,57 37,56 37,55.25 R30.1 38.68,56.69 U1.36 | v49,53 50.64,53 50.65,53.01 72.4,53.01 A1.P$19 JP3.19 81.63,48 R34.2
  Bottom 0.152: v49,53 38,53 36,55 v36,57
!RESET!_ADS_1
  Top 0.152: R34.1 86.15,51.65 87.8,53.3 U2.36
+3.3V-MBED  (via drill 0.35 pad 0.55)
  Top 0.305: JP2.20 A1.VOUT 73.89,2.21 75.2,0.9 100.1,0.9 103.6,4.4 | 103.6,4.4 JP1.2 | J1.4 124.2,14.79 v124,15 | v121,8 121,4 119,2 106,2 103.6,4.4
  Bottom 0.305: JP2.20 45.02,8 42.74,8 R11.1 | v124,15 124,11 v121,8
+3.3V-REG  (via drill 0.35, 0.35 pad 0.55)
  Top 0.152: R23.2 99.95,58.2
  Top 0.254: U2.50 95.09,60.09 v94.5,59.5 | U2.35 87.3,56.3 v87.2,56.2 | v94.4,56.5 94.26,56.5 93.8,56.96 U2.48 | R32.2 89.28,51.02 v89.3,51
  Top 0.305: R31.2 39.66,52.14 v40.1,51.7 | 99.95,58.2 v101.4,58.2 | R30.2 37.12,52.28 v37.7,51.7 | v45.35,57.48 45.35,57.5 44.68,58.16 U1.48 | 47.95,60.55 | 47.95,60.55 v48.2,60.3 | U1.50 47.41,61.09 47.95,60.55 | R22.2 52.53,58.9 v53.2,58.9 | v38.2,59.9 38.18,59.88 U1.35
  Bottom 0.152: C14.1 45.35,56.51 v45.35,57.48
  Bottom 0.254: v94.4,56.5 94.4,55.46 C26.1
  Bottom 0.305: C14.1 C15.1 | R10.1 27.67,20.6 v28.5,20.6 | C26.1 C27.1
  other vias: 72.2,49.7 73.4,49.7 74.6,49.8 74.6,48.6 74.6,47.4 73.4,47.3 73.4,48.5 72.2,48.5 72.2,47.3 71.2,47.9 70.3,47.2 69.5,48 68,48.6 68.7,49.5 67.4,49.6
  pour Route2: -2,108 -2,-4 134,-4 134,108
  pour Top (no thermals): 67,47 75,47 75,50 68,50 67,50
+5V  (via drill 0.35, 0.35 pad 0.55)
  Top 0.152: A1.VIN JP3.2
  Top 0.254: v48.1,65.71 47.98,65.59 U1.59 | v97.84,64.44 97.16,64.44 97,64.6 U2.59 | U1.19 34.01,67.09 v33.9,67.2
  Top 0.305: U3.1 33.2,23.89 v33.2,22.4 | v33.4,34.5 L1.2 | v62,49.4 62,47.94 C11.1 U5.1 65.85,47.75 66.1,47.5 66.1,46.2 65.74,45.84 U5.3 64.74,45.84 64.6,45.7 64,45.7 v63.6,45.3 | U1.56 45.59,64.09 v45.4,63.9 | U1.54 45.84,63.09 45.69,63.24 v44.46,63.24 | U2.19 85.26,66.09 85.43,66.26 85.65,66.26 v86.1,66.71 | U2.21 84.51,64.85 84.53,64.85 | 84.53,64.85 v86.52,64.85 | U2.22 84.53,64.85 | U2.54 94.74,62.09 94.57,62.26 93.44,62.26 v93.4,62.3 | U2.56 94.49,63.09 v94.4,63
  Top 0.813: C2.1 36.15,38.9
  Bottom 0.254: C16.1 48.62,65.19 v48.1,65.71 | C28.1 97.97,64.57 v97.84,64.44
  Bottom 0.305: v33.4,34.5 33.2,34.3 v33.2,22.4 33.2,19.8 40.2,12.8 v42.1,12.8 v44.1,12.8 | U17.2 113.26,28.34 v113.3,28.3 | U11.2 68.63,87.63 v68.7,87.7 | C28.1 C29.1 | C16.1 C17.1 | R9.1 23.24,20.2 v24.4,20.2
  other vias: 34.5,38.9 33.8,65.9 34.5,41.2 34.5,36.7 32.8,37.7 32.8,40
  pour Route15: -3,-3 135,-3 135,0 135,108 128,108 -3,108 -3,103
  pour Top (no thermals): 36.1,65.6 33.5,65.6 33.5,66.1 36.1,66.1
  cutout Route15: 26,35 48,35 48,12 38,12 26,24
  pour Top (no thermals): 41,15.4 41,12.1 45,12.1 45,15.4
  pour Top (no thermals): 36.8,42.1 36.8,34 31.1,34 31.1,42 31,42.1
+9V  (via drill 0.35 pad 0.55)
  Top 0.813: U3.8 38.86,27.52 C5.1 C6.1 C7.1 R1.2 47.11,27.89 48,27 48,8.01 SW2.1 33,15.15 33,17.5 v28.25,22.25 26.75,23.75 26.75,26.75 28.66,28.66 C4.1
  Bottom 0.305: v28.25,22.25 21.26,22.25 R8.1
  pour Top (no thermals): 34,27 31,27 28,27 27,28 27,30 28,31 30,31 32,31 34.6,28.4 34.6,27.6
+9V-CON
  Top 0.813: SW1.3 23.56,4.08 20.82,6.82 19.82,7.82 13.88,13.76 J4.PWR
+9V_BATT
  Top 0.813: J2.P$1 16.48,2 26.02,2 SW1.2
AIN1N  (via drill 0.35 pad 0.55)
  Top 0.152: 25.4,44.33 R45.8 | 25.4,44.33 25.4,65.97 30.45,71.02 37.41,71.02 37.68,70.75 U1.15 | v26.8,44.4 25.47,44.4 25.4,44.33
  Bottom 0.152: CA5.8 26.78,44.38 v26.8,44.4
AIN1P  (via drill 0.35)
  Top 0.152: U1.16 30.16,70.12 26.2,66.16 26.2,45.82 27.38,44.64 27.38,44.16 27.04,43.82 25.8,43.82 v24.99,43.01 R45.7
  Bottom 0.152: CA5.7 26.7,41.3 v24.99,43.01
AIN2N  (via drill 0.35)
  Top 0.152: U1.13 38.55,70.25 38.55,70.88 37.8,71.62 30.16,71.62 23.22,64.69 v22.2,64.69 RA4.6
  Bottom 0.152: CA4.6 23.12,64.69 v22.2,64.69
AIN2P  (via drill 0.35)
  Top 0.152: U1.14 38.05,70.25 38.05,70.88 37.61,71.32 30.32,71.32 22.77,63.77 RA4.5 21.4,63.61 v21.4,62.8
  Bottom 0.152: v21.4,62.8 22.54,63.94 CA4.5
AIN3N  (via drill 0.35)
  Top 0.152: U1.11 39.55,70.25 39.55,70.88 38.2,72.23 29.83,72.23 24.72,67.12 v22.2,67.12 21.84,67.12 RA4.8
  Bottom 0.152: CA4.8 22.41,67.12 v22.2,67.12
AIN3P  (via drill 0.35)
  Top 0.152: U1.12 39.05,70.25 39.05,70.88 38,71.93 30.03,71.93 24,65.9 v22.2,65.9 21.54,65.9 RA4.7
  Bottom 0.152: CA4.7 22.56,65.54 v22.2,65.9
AIN4N  (via drill 0.35)
  Top 0.152: RA3.6 v20.43,80.42 27.55,73.31 39.7,73.31 40.68,72.32 U1.9
  Bottom 0.152: CA3.6 19.66,78.85 19.66,78.89 20.43,79.66 v20.43,80.42
AIN4P  (via drill 0.35)
  Top 0.152: U1.10 40.18,71.89 39.07,73 26.93,73 18.97,80.97 RA3.5 18.32,81.52 v17.4,80.6
  Bottom 0.152: CA3.5 18.49,79.51 v17.4,80.6
AIN5N  (via drill 0.35)
  Top 0.152: U1.7 41.55,70.25 41.55,72.45 40,74 28.68,74 v23.34,79.34 RA3.8
  Bottom 0.152: v23.34,79.34 22.48,78.48 CA3.8
AIN5P  (via drill 0.35)
  Top 0.152: RA3.7 v21.88,79.88 28.15,73.61 39.96,73.61 41.05,72.52 41.05,70.25 U1.8
  Bottom 0.152: v21.88,79.88 21.02,79.03 20.59,79.03 20.46,78.89 20.46,78.85 CA3.7
AIN6N  (via drill 0.35)
  Top 0.152: RA2.6 v31.28,80.5 31.28,77.32 33.6,75 40.1,75 42.68,72.42 U1.5
  Bottom 0.152: CA2.6 31.34,80.44 v31.28,80.5
AIN6P  (via drill 0.35)
  Top 0.152: U1.6 42.05,70.25 42.05,70.88 42,70.93 42,72.67 40.17,74.5 33.3,74.5 30.37,77.43 RA2.5 29.55,80.8 v29.5,80.8
  Bottom 0.152: v29.5,80.8 30.54,79.76 CA2.5
AIN7N  (via drill 0.35)
  Top 0.152: U1.3 43.68,72.62 40.5,75.8 34.8,75.8 33.11,77.49 v33.11,80.5 RA2.8
  Bottom 0.152: CA2.8 32.94,80.33 v33.11,80.5
AIN7P  (via drill 0.35)
  Top 0.152: U1.4 43.18,72.52 40.3,75.4 34.2,75.4 32.2,77.4 v32.2,79.7 RA2.7
  Bottom 0.152: CA2.7 32.14,79.64 v32.2,79.7
AIN8N  (via drill 0.35)
  Top 0.152: U1.1 44.68,71.68 v53,80 54.14,81.14 RA1.6
  Bottom 0.152: v53,80 54.2,78.8 CA1.6
AIN8P  (via drill 0.35)
  Top 0.152: U1.2 44.18,71.61 52,79.43 v52,81 52.61,81 RA1.5
  Bottom 0.152: CA1.5 52,79.88 v52,81
AIN9N  (via drill 0.35)
  Top 0.152: U2.15 86.8,70.4 80.2,77 v80.2,80 80.2,81.52 R14.8
  Bottom 0.152: CA10.8 79.93,79.73 v80.2,80
AIN9P  (via drill 0.35)
  Top 0.152: U2.16 86.3,70.3 79.2,77.4 v79.2,80.6 79.2,81.6 R14.7
  Bottom 0.152: CA10.7 79.13,80.53 v79.2,80.6
AIN10N  (via drill 0.35)
  Top 0.152: U2.13 87.8,71.8 94.4,78.4 98.5,78.4 99.86,79.76 v99.86,80 RA8.6
  Bottom 0.152: CA9.6 99.92,79.94 v99.86,80
AIN10P  (via drill 0.35)
  Top 0.152: U2.14 87.3,72.2 94.1,79 97.8,79 98.95,80.15 RA8.5 97.92,81.62 v97.9,81.6
  Bottom 0.152: v97.9,81.6 99.12,80.38 CA9.5
AIN11N  (via drill 0.35)
  Top 0.152: U2.11 88.8,71.2 94.6,77 100,77 101.69,78.69 RA8.8 102.52,81.62 v102.6,81.7
  Bottom 0.152: v102.6,81.7 102.6,79.56 CA9.8
AIN11P  (via drill 0.35)
  Top 0.152: U2.12 88.3,71.7 94.3,77.7 99.7,77.7 100.78,78.78 RA8.7 100.78,80.73 v100.84,80.67
  Bottom 0.152: CA9.7 100.72,80.54 v100.84,80.67
AIN12N  (via drill 0.35)
  Top 0.152: U2.9 89.8,70.2 92.2,72.6 107.2,72.6 111.72,77.12 v111.72,78.7 RA7.6
  Bottom 0.152: CA8.6 111.78,78.64 v111.72,78.7
AIN12P  (via drill 0.35)
  Top 0.152: U2.10 89.3,70.3 92,73 106.9,73 110.81,76.91 RA7.5 109.72,80.62 v109.7,80.6
  Bottom 0.152: v109.7,80.6 110.98,79.32 CA8.5
AIN13N  (via drill 0.35)
  Top 0.152: U2.7 90.8,70.2 92.4,71.8 108.9,71.8 113.55,76.45 RA7.8 113.57,80.6 v114.5,80.6
  Bottom 0.152: CA8.8 113.38,79.48 v114.5,80.6
AIN13P  (via drill 0.35)
  Top 0.152: RA7.7 v112.64,79.6 112.64,77.24 107.6,72.2 92.4,72.2 90.3,70.1 U2.8
  Bottom 0.152: CA8.7 112.58,79.54 v112.64,79.6
AIN14N  (via drill 0.35)
  Top 0.152: U2.5 91.8,70 92.9,71.1 104.3,71.1 107.1,68.3 107.1,64.1 v108.1,63.1 108.26,62.94 RA6.6
  Bottom 0.152: v108.1,63.1 108.1,62.29 108.09,62.28 108.09,59.11 CA7.6
AIN14P  (via drill 0.35 pad 0.55)
  Top 0.152: U2.6 91.3,70.1 92.6,71.4 104.6,71.4 107.4,68.6 107.4,64.6 108,64 v108.8,64 108.94,63.86 RA6.5
  Bottom 0.152: CA7.5 107.41,63.41 108,64 108.76,64 v108.8,64
AIN15N  (via drill 0.35)
  Top 0.152: U2.3 92.8,70 93.2,70.4 103.8,70.4 106.4,67.8 106.4,62.6 107.88,61.12 RA6.8 109.83,60.03 v109.8,60
  Bottom 0.152: CA7.8 109.81,59.99 v109.8,60
AIN15P  (via drill 0.35)
  Top 0.152: U2.4 92.3,70 93.1,70.8 104,70.8 106.8,68 106.8,63.2 107.97,62.03 v108.7,62.03 RA6.7
  Bottom 0.152: CA7.7 108.7,59.3 v108.7,62.03
AIN16N  (via drill 0.35)
  Top 0.152: U2.1 97.99,69.12 98.34,69.46 103.54,69.46 105.4,67.6 105.4,40.4 107.1,38.7 RA5.6 108.21,38.7 v108,38.91
  Bottom 0.152: v108,38.91 106.55,38.91 CA6.6
AIN16P  (via drill 0.35)
  Top 0.152: U2.2 93.3,69.71 93.59,70 103.6,70 106,67.6 106,40.8 107.19,39.61 RA5.5 109.73,40.57 v109.7,40.6
  Bottom 0.152: CA6.5 107.45,40.6 v109.7,40.6
B1
  Top 0.152: A1.VB JP3.3
B2
  Top 0.152: A1.NR JP3.4
B5
  Top 0.152: A1.P$21 JP2.1
B6
  Top 0.152: A1.P$23 JP2.3
B7
  Top 0.152: A1.P$24 JP2.4
B8  (via drill 0.35 pad 0.55)
  Top 0.152: A1.P$26 JP2.6
  Top 0.254: A1.P$26 54.62,38.1 v63.4,38.1 | v73.5,35.6 75.1,34 90,34 103.5,20.5 v113.1,20.5 | v113.1,11.4 114.93,11.4 J1.12
  Bottom 0.254: v63.4,38.1 65.3,40 69.1,40 v73.5,35.6 | v113.1,20.5 v113.1,11.4
B10
  Top 0.152: A1.D+ JP2.11
B11
  Top 0.152: A1.D- JP2.12
B12
  Top 0.152: A1.TD+ JP2.13
B13
  Top 0.152: A1.TD- JP2.14
B14
  Top 0.152: A1.RD+ JP2.15
B15
  Top 0.152: A1.RD- JP2.16
B16
  Top 0.152: A1.IF+ JP2.17
B17
  Top 0.152: A1.IF- JP2.18
B18
  Top 0.152: A1.VU JP2.19
BATT_SWITCH
  Top 0.813: SW1.1 SW2.3
BIAS
  Top 0.152: RA1.1 55.97,86.55 J21.PWR 60.95,95 | 60.95,95 60.95,98.83 J21.GND | 60.95,95 60.66,94.71 J21.GNDBREAK
  Bottom 0.152: U11.4 64.65,87.22 64.38,87.22 60.95,90.65 J21.PWR | J21.PWR 60.95,98.83 J21.GND | J21.PWR 57.77,94.71 J21.GNDBREAK
BIAS1_IN
  Top 0.152: U2.63 95.94,66.71 99,66.71 | 99,66.71 R13.2 99.27,66.8 C37.2 | U2.62 98.38,66.09 99,66.71
BIAS_1
  Top 0.152: RA5.1 117.41,31.06 J23.PWR 121.98,31.06 | 121.98,31.06 125.64,31.06 J23.GND | J23.GNDBREAK 121.52,31.52 121.98,31.06
  Bottom 0.152: 120.28,31.06 J23.PWR 114,31.06 113,31.06 112.6,31.46 U17.4 | 120.28,31.06 125.64,31.06 J23.GND | J23.GNDBREAK 121.52,32.29 120.28,31.06
BIAS_DRV  (via drill 0.35)
  Top 0.152: R12.1 48.74,69.6 C25.1 56,74.82 v56,80 55.97,80.03 RA1.8
  Bottom 0.152: v56,80 56,78.68 CA1.8
BIAS_DRV_1  (via drill 0.35)
  Top 0.152: R13.1 101.1,68.61 C37.1 103.5,68.5 105,67 105,40 108.13,36.87 RA5.8 109.73,35.83 v109.7,35.8
  Bottom 0.152: v109.7,35.8 107.53,35.8 CA6.8
BIAS_IN
  Top 0.152: U1.62 47.11,67.09 47.2,67.19 48.02,67.19 48.42,67.58 | 48.42,67.58 R12.2 48.74,67.9 C25.2 | U1.63 48.41,67.59 48.42,67.58
BIAS_INV
  Top 0.152: U1.61 46.74,66.62 47.37,66.62 47.63,66.88 JP4.2
BIAS_INV_1
  Top 0.152: U2.61 103.86,65.59 JP5.2
BIAS_REF
  Top 0.152: R29.1 49.66,66.09 48.54,66.09 48.34,66.29 47.86,66.29 47.66,66.09 U1.60
BIAS_REF_1
  Top 0.152: U2.60 98.78,65.09 R28.1
BLE_EN  (via drill 0.35)
  Top 0.152: A1.P$17 81,42.85 JP3.17 86.15,42.85 88,41 v88,36 | JP7.1 113.56,8 107,8 95,20 v89,20
  Bottom 0.152: v89,20 89,35 v88,36
BLE_RX
  Top 0.152: A1.P$9 JP3.9 95.47,22.53 109,9 126,9 127.32,7.68 JP7.5
BLE_STATE
  Top 0.152: A1.P$18 JP3.18 88.53,45.39 88.75,45.61 89.25,45.61 89.47,45.39 91.61,45.39 114,23 126,23 131,18 131,5.54 JP7.6
BLE_TX  (via drill 0.35)
  Top 0.152: A1.P$10 JP3.10 | JP7.4 124.78,7.22 123.4,8.6 107.4,8.6 95,21 v86,21
  Bottom 0.152: v86,21 81.93,25.07 JP3.10
BYPASS
  Top 0.305: U5.4 70.31,45.84 C12.1
CBOOT
  Top 0.305: U3.14 34,25.87 33.6,25.87 33.43,25.7 33.43,25.65 32.89,25.11 R2.1
  Top 0.813: C8.2 R2.1
CLK
  Top 0.152: U2.37 88.37,57.63 88.37,58.24 87.88,58.72 86.12,58.72 85.12,57.72 85.12,57.12 83.2,55.2 R19.1
CLK_ADS
  Top 0.152: R19.2 67.25,55.2 R18.2 64.68,55.77 62.17,58.28 48.78,58.28 47.24,59.82 44,59.82 43.24,60.58 39.72,60.58 39.39,60.25 39.39,59.38 39.34,59.32 39.34,58.72 U1.37
CLK_HDR
  Top 0.152: JP6.1 66.82,57.53 R18.1
CLKSEL_0
  Top 0.152: U1.52 46.74,62.06 47.37,62.06 49.77,59.66 R22.1
CLKSEL_1
  Top 0.152: U2.52 95.84,61.07 96.48,61.07 97.99,59.56 R23.1
DEBUG_1
  Top 0.152: JP2.9 A1.P$29 58.85,30.15 75.6,13.4 92.53,13.4 R15.1
DEBUG_2  (via drill 0.35)
  Top 0.152: A1.P$25 JP2.5 | R16.1 83.13,9.87 82,11 75,11 v57,29
  Bottom 0.152: v57,29 57,37.93 A1.P$25
DEBUG_3  (via drill 0.35)
  Top 0.152: A1.P$22 JP2.2 | R17.1 90.54,11.3 75.4,11.3 58.16,28.54 v58.16,29
  Bottom 0.152: v58.16,29 58.16,44.39 A1.P$22
EN
  Top 0.305: U3.7 45.39,26.45 R1.1
FB
  Top 0.305: R4.2 C10.2 39.17,17.25 R3.1 39.17,21.83 36.2,24.8 U3.4
FB_CAP
  Top 0.305: R5.2 44.08,16.61 C10.1
GND  (via drill 0.35, 0.35 pad 0.55)
  Top 0.152: A1.GND JP3.1 | R29.2 v53.49,65.61 v53.5,65.6 | RA5.7 108.23,37.78 v108.19,37.75 | v112.72,37.46 111.92,37.46 RA5.2 | R28.2 102.49,64.61 v102.6,64.5 | J1.10 129,9.19 | D1.C 19.08,10.78 v19,10.7 | D2.C 23.08,10.68 v23,10.6 | D3.C 27.08,10.58 v27,10.5 | D4.C 30.98,10.62 v31,10.6
  Top 0.254: 45.84,61.59 45.82,61.61 | v45.46,61.61 v45.45,61.62 | v48.3,50.1 47.11,50.1 R7.2 R6.2 v48.3,48.1 | R26.2 94.46,51.11 v94.64,50.94 | R27.1 92.4,51.55 v92.4,51.1 | R24.2 98.07,48.47 v98.1,48.5 | R25.2 97.98,46.18 v98,46.2
  Top 0.305: D6.C v92.07,1.63 | D5.C v87.98,1.63 | D7.C v96.06,1.63 | J1.6 125.9,12.7 v127.4,12.7 | C24.2 30.2,67.5 v29.3,68.4 | C23.2 32.6,67.6 v32.2,68 | U1.23 v36.49,65.09 v36.5,65.1 | U1.20 v36.6,66.6 | U1.25 v36.49,64.09 v36.5,64.1 | U1.31 v36.49,61.09 v36.5,61.1 | C21.2 32.62,59.5 v31.4,59.5 | v34,60.1 34.03,60.07 34.55,60.59 U1.32 | C18.2 48.43,61.97 v48.4,62 | C19.2 53.83,61.97 v53.9,61.9 | v45.4,65.1 46.7,65.1 U1.58 | v48,64.6 U1.57 | U1.53 45.39,62.59 v45.3,62.5 | U1.64 v45.31,68.09 v45.3,68.1 | RA1.7 55.06,80.76 v55,80.7 | U1.49 v45.41,60.59 v45.4,60.6 | R21.1 v42.2,51.7 | R20.2 44.74,51.74 v44.7,51.7 | C20.2 31.64,61.54 v31.4,61.3 | U1.33 37.18,58.36 36.88,58.06 36.34,58.06 v36.3,58.1 | U1.41 41.18,59.78 v41.2,59.8 | U2.53 v94.31,61.59 v94.3,61.6 | U2.51 v94.31,60.59 v94.3,60.6 | U2.49 96.33,59.59 96.7,59.22 v96.7,58.5 | U2.58 v94.21,64.09 v94.2,64.1 | U2.57 v97.1,63.6 | C31.2 102.78,61.22 v103,61 | C30.2 98.97,61 v98,61 | U2.41 v90.3,59 | U2.32 83.59,59.59 v83,59 | C33.2 80.43,58.17 v80.4,58.2 | U2.31 v85.59,60.09 v85.6,60.1 | U2.25 v85.69,63.09 v85.7,63.1 | U2.23 v85.69,64.09 v85.7,64.1 | C35.2 81.1,66.75 v81.1,67.1 | C36.2 79.5,66.6 v78.2,66.6 | U2.20 84.28,65.6 v85.7,65.6 | RA1.2 55,83.54 v55,84.6 | U2.33 86.3,56.8 86.07,56.58 86.07,56.07 v86,56 | C9.2 36.88,22.22 35.68,23.42 U3.3 | C11.2 v61.8,44.3 | U5.2 v63.6,46.8 | C12.2 68.81,43.81 v68.8,43.8 | C13.2 v68.81,51.41 v68.8,51.4 | U2.64 96.09,67.09 v97,68 | U1.51 45.84,61.59 | 45.82,61.61 v45.46,61.61 | C32.2 80.66,63.33 v80.8,63.47 | 129,9.19 v129,8.4 | v129.1,24.3 129.16,24.24 J1.9 | U3.6 38.45,25.95 v38.7,25.7
  Top 0.61: C4.2 31.2,30.59 v31.2,31.9
  Top 0.813: U3.11 32.84,30.56 C4.2 | 38.45,41 C3.2
  Bottom 0.152: CA3.4 CA3.3 CA3.2 CA3.1 | CA5.4 CA5.1 | CA4.1 CA4.2 CA4.3 CA4.4 | CA2.4 CA2.3 CA2.2 CA2.1 | C22.2 29.36,63 v28,63
  Bottom 0.254: 48.48,54.48 48.5,54.5
  other vias: 40,41 39,32 41,32 44,32 36.9,17.4 37,20.1 40,39 40,37 41,40 41,38
  pour Bottom (no thermals): -2,-5 -2,104 -1,105 133.88,105 133.88,-5
  pour Top (no thermals): 36.8,28.6 36.8,29.8 37.8,29.8 37.8,32.6 45.3,32.6 45.5,32.4 45.5,28.9 37.7,28.9 37.7,28.6
  pour Top (no thermals): 36.1,22.5 36.1,16.5 38,16.5 38,22.5
  pour Top (no thermals): 37.6,41.9 37.6,36.1 42.4,36.1 42.4,42.1 37.6,42.1
LED-1
  Top 0.152: R15.2 D7.A
LED_2
  Top 0.152: R16.2 D5.A
LED_3
  Top 0.152: R17.2 91.97,5.54 D6.A
MISO_ADS  (via drill 0.35)
  Top 0.152: A1.P$6 JP3.6 81.65,15 v90,15 | U1.43 42.18,56.82 v42.2,56.8 | v40.93,56.08 41,56.01 41,50 46.8,44.2 58.8,44.2 64.5,38.5 64.5,29.6 v74.6,19.5 | U2.43 91.3,56 v91.5,55.8 | v89,45 103.7,30.3 v103.7,25.9
  Bottom 0.152: v42.2,56.8 41.65,56.8 v40.93,56.08 | v74.6,19.5 74.6,16.4 76.09,14.91 A1.P$6 | v91.5,55.8 91.5,50.36 91.39,50.25 91.39,47.39 v89,45 | v103.7,25.9 101.9,25.9 94.6,18.6 92.7,18.6 90,15.9 v90,15
MISO_SD  (via drill 0.35)
  Top 0.152: A1.P$12 JP3.12 | J1.7 123.48,11.52 120,15 106,15 95,26 v86,26
  Bottom 0.152: v86,26 81.85,30.15 JP3.12
MOSI_ADS  (via drill 0.35)
  Top 0.152: A1.P$5 81,12.37 | 81,12.37 JP3.5 | U2.34 86.8,56.8 86.61,56.61 86.61,55.75 86.25,55.39 85.39,55.39 v84.3,54.3 84,54 52.1,54 v47.2,58.9 | v85.7,44.2 102.08,27.82 v102.08,24.72 | v90.5,12.6 81.23,12.6 81,12.37 | v37.16,57 37.7,57.54 37.7,58.54 U1.34
  Bottom 0.152: v85.7,44.2 84.3,45.6 84.3,52.45 84.11,52.63 84.11,53.37 84.3,53.55 v84.3,54.3 | v102.08,24.72 95.36,18.01 94.05,18.01 94.04,18 94,18 90.5,14.5 v90.5,12.6 | v37.16,57 37.16,57.16 38,58 44.6,58 45.51,58.9 v47.2,58.9
MOSI_SD
  Top 0.152: A1.P$11 81,27.61 JP3.11 95.39,27.61 103.08,19.92 113.34,19.92 113.42,20 120,20 124.11,15.89 J1.3
N$1
  Top 0.152: R21.2 42.18,55.13 41.59,55.72 41.59,58.48 U1.42
N$2
  Top 0.152: U1.45 43.18,56.76 43.7,56.24 43.7,51.4 44.91,50.19 R7.1
N$3
  Top 0.152: R6.1 45.12,48.4 43.38,50.14 43.38,56.08 42.81,56.65 42.81,58.44 U1.44
N$4
  Top 0.152: U1.46 43.71,58.53 43.71,56.7 44.74,55.67 R20.1
N$5
  Top 0.152: U2.45 92.3,56.3 93.4,55.2 93.4,50.26 93.39,50.25 93.39,48.91 93.83,48.47 R24.1
N$6
  Top 0.152: U2.44 91.83,57.53 91.83,56.34 93.09,55.07 93.09,47.29 R25.1
N$7
  Top 0.152: U2.46 92.93,57.43 92.93,56.67 94.46,55.15 R26.1
N$8
  Top 0.152: U2.42 90.8,55.05 R27.2
RBOOT
  Top 0.305: U3.13 32.33,26.45 R2.2
SCK_SD  (via drill 0.35)
  Top 0.152: A1.P$13 JP3.13 | v88,27 95,27 103,19 120.16,19 123.58,15.58 123.58,15.4 123.42,15.24 123.42,14.58 124.3,13.7 J1.5
  Bottom 0.152: v88,27 82.31,32.69 JP3.13
SCL_IMU
  Top 0.152: JP2.7 A1.P$27 59.77,35.23 64,31 64,29 74.3,18.7 94.54,18.7 JP1.4
SCLK_ADS  (via drill 0.35)
  Top 0.152: A1.P$7 81,17.45 | 81,17.45 JP3.7 | U2.40 89.8,58.2 v89,59 | v86.9,44.6 103,28.5 v103,24 | v94.3,17.4 81.05,17.4 81,17.45 | U1.40 40.68,57.27 v40.7,57.24 | v86,54 85.69,53.69 84.05,53.69 84.04,53.7 51.6,53.7 47.43,57.87 47.43,57.92 47.09,58.26 46.24,58.26 v46.2,58.3
  Bottom 0.152: v89,59 89,57 v86,54 85.61,53.61 84.75,53.61 84.39,53.25 84.39,52.75 84.58,52.56 84.58,46.92 v86.9,44.6 | v103,24 96.4,17.4 v94.3,17.4 | v40.7,57.24 41.79,57.24 41.95,57.41 44.41,57.41 45.3,58.3 v46.2,58.3
SDA_IMU
  Top 0.152: JP2.8 A1.P$28 61.31,32.69 63,31 63,28 75,16 94.7,16 JP1.3
SRB1  (via drill 0.35)
  Top 0.152: U1.17 35.29,67.96 36.1,67.96 36.16,67.89 36.59,67.89 37.6,66.88 37.6,60.87 35.15,58.42 35.15,51.1 23.58,39.53 R45.5 23.47,39.53 24,39 24.4,39 v24.9,39.5
  Bottom 0.152: v24.9,39.5 25.1,39.7 CA5.5
SRB1_1  (via drill 0.35)
  Top 0.152: U2.17 83.11,67.09 77.1,73.1 v77.1,80.2 77.1,81.36 R14.5
  Bottom 0.152: CA10.5 77.1,78.91 v77.1,80.2
SRB1_OUT
  Top 0.152: R45.4 14.76,32.81 J22.PWR
  Bottom 0.152: U10.5 17.02,36 J22.PWR
SRB1_OUT_1
  Top 0.152: R14.4 72.38,88.46 J24.PWR
  Bottom 0.152: U16.5 76.28,87.63 J24.PWR
SRB2  (via drill 0.35)
  Top 0.152: U1.18 36.47,67.59 37.3,66.76 37.3,61 34.8,58.5 34.8,51.58 27.66,44.44 27.66,44.04 27.16,43.54 26.74,43.54 v24.95,41.75 23.64,40.44 R45.6
  Bottom 0.152: CA5.6 26.2,40.5 v24.95,41.75
SRB2_1  (via drill 0.35)
  Top 0.152: U2.18 85.19,66.59 85.4,66.8 85.4,67.9 78.2,75.1 v78.2,80 78.2,81.54 R14.6
  Bottom 0.152: CA10.6 78.2,78.61 v78.2,80
SRB2_OUT
  Top 0.152: R45.3 14.16,40.44 10.65,36.93 | 10.65,36.93 J22.GND | 10.65,36.93 J22.GNDBREAK
  Bottom 0.152: U10.2 16.77,39.99 16.77,39.72 10.51,33.46 | 10.51,33.46 9.85,32.79 J22.GND | J22.GNDBREAK 10.65,33.32 10.51,33.46
SRB2_OUT_1
  Top 0.152: R14.3 78.27,87.47 78.3,87.5 78.3,92.91 76.1,95.1 | 76.1,95.1 J24.GND | 76.1,95.1 75.71,94.71 J24.GNDBREAK
  Bottom 0.152: U16.2 79.62,87.87 79.35,87.87 77,90.22 77,94.21 76.5,94.71 | 76.5,94.71 J24.GND | J24.GNDBREAK 76.5,94.71
START_ADS  (via drill 0.35, 0.35 pad 0.55)
  Top 0.152: A1.P$16 JP3.16 83.31,40.31 v84,41 | U1.38 39.68,59.68 v40,60 | U2.38 88.8,58.2 88,59 86,59 v84,57 74,57 71,60 v53,60
  Bottom 0.152: v84,41 83.4,41.6 83.4,56.4 v84,57 | v53,60 52.69,59.69 45.45,59.69 44.73,60.41 43.41,60.41 43.24,60.58 41.12,60.58 40.54,60 v40,60
SW
  Top 0.305: C8.1 30.72,27 35.4,27 35.68,27.28 U3.10
  pour Top (no thermals): 35.5,27 35.9,27 35.9,29.6 37.2,30.9 37.2,32.9 34.1,32.9 34.1,31 35.6,29.5 35.6,27.1
VCAP1  (via drill 0.35)
  Top 0.305: v33.9,62.4 34.09,62.59 U1.28
  Bottom 0.305: v33.9,62.4 33.41,62.4 C22.1
VCAP1_1  (via drill 0.35 pad 0.55)
  Top 0.305: U2.28 83.29,61.59 83.05,61.35 v83.05,61.33
  Bottom 0.305: C34.1 81.91,61.3 83.02,61.3 v83.05,61.33
VCAP2
  Top 0.305: U1.30 33.01,61.59 C21.1
VCAP2_1
  Top 0.305: U2.30 82.64,60.59 C33.1
VCAP3
  Top 0.152: 49.74,63.59 C18.1
  Top 0.305: U1.55 49.74,63.59 | C18.1 C19.1
VCAP3_1
  Top 0.305: U2.55 98.86,62.59 C30.1 C31.1
VCAP4
  Top 0.305: U1.26 33.44,63.59 C20.1
VCAP6
  Top 0.305: U2.26 82.56,62.59 C32.1
VCC_CHIP
  Top 0.305: U3.2 35.16,21.65 C9.1
VREFP
  Top 0.305: JP8.1 30.13,65.16 C24.1 30.98,65.19 C23.1 33.82,65.19 34.46,64.55 35.11,64.55 U1.24
VREFP_1
  Top 0.305: U2.24 83.51,63.59 82.99,64.11 82.99,64.13 C35.1 80.07,64.13 C36.1 76.86,64.54 JP9.1

## Text on the board
tPlace: 12 | 5 | 4 | LBIAS | RSRB1 | 9 | 10 | 11 | 13 | 6 | 7 | 8 | 3.3V-MBED | 3 | 14 | 2 | 15 | 1 | 16 | LSRB1 | RBIAS | 9V | 5V | 3.3VR | 3.3VM | DBG2 | DBG3 | DBG1 | GND | - | + | JACK | BATT | ON | OFF | IMU | BLUETOOTH | GND | BLE_EN
bPlace: Fall 2021 | Wireless Low Cost EEG Cap